# EAGLE design MonthCalendar_TouchPlate_v0.8 (EAGLE 9.4.1)
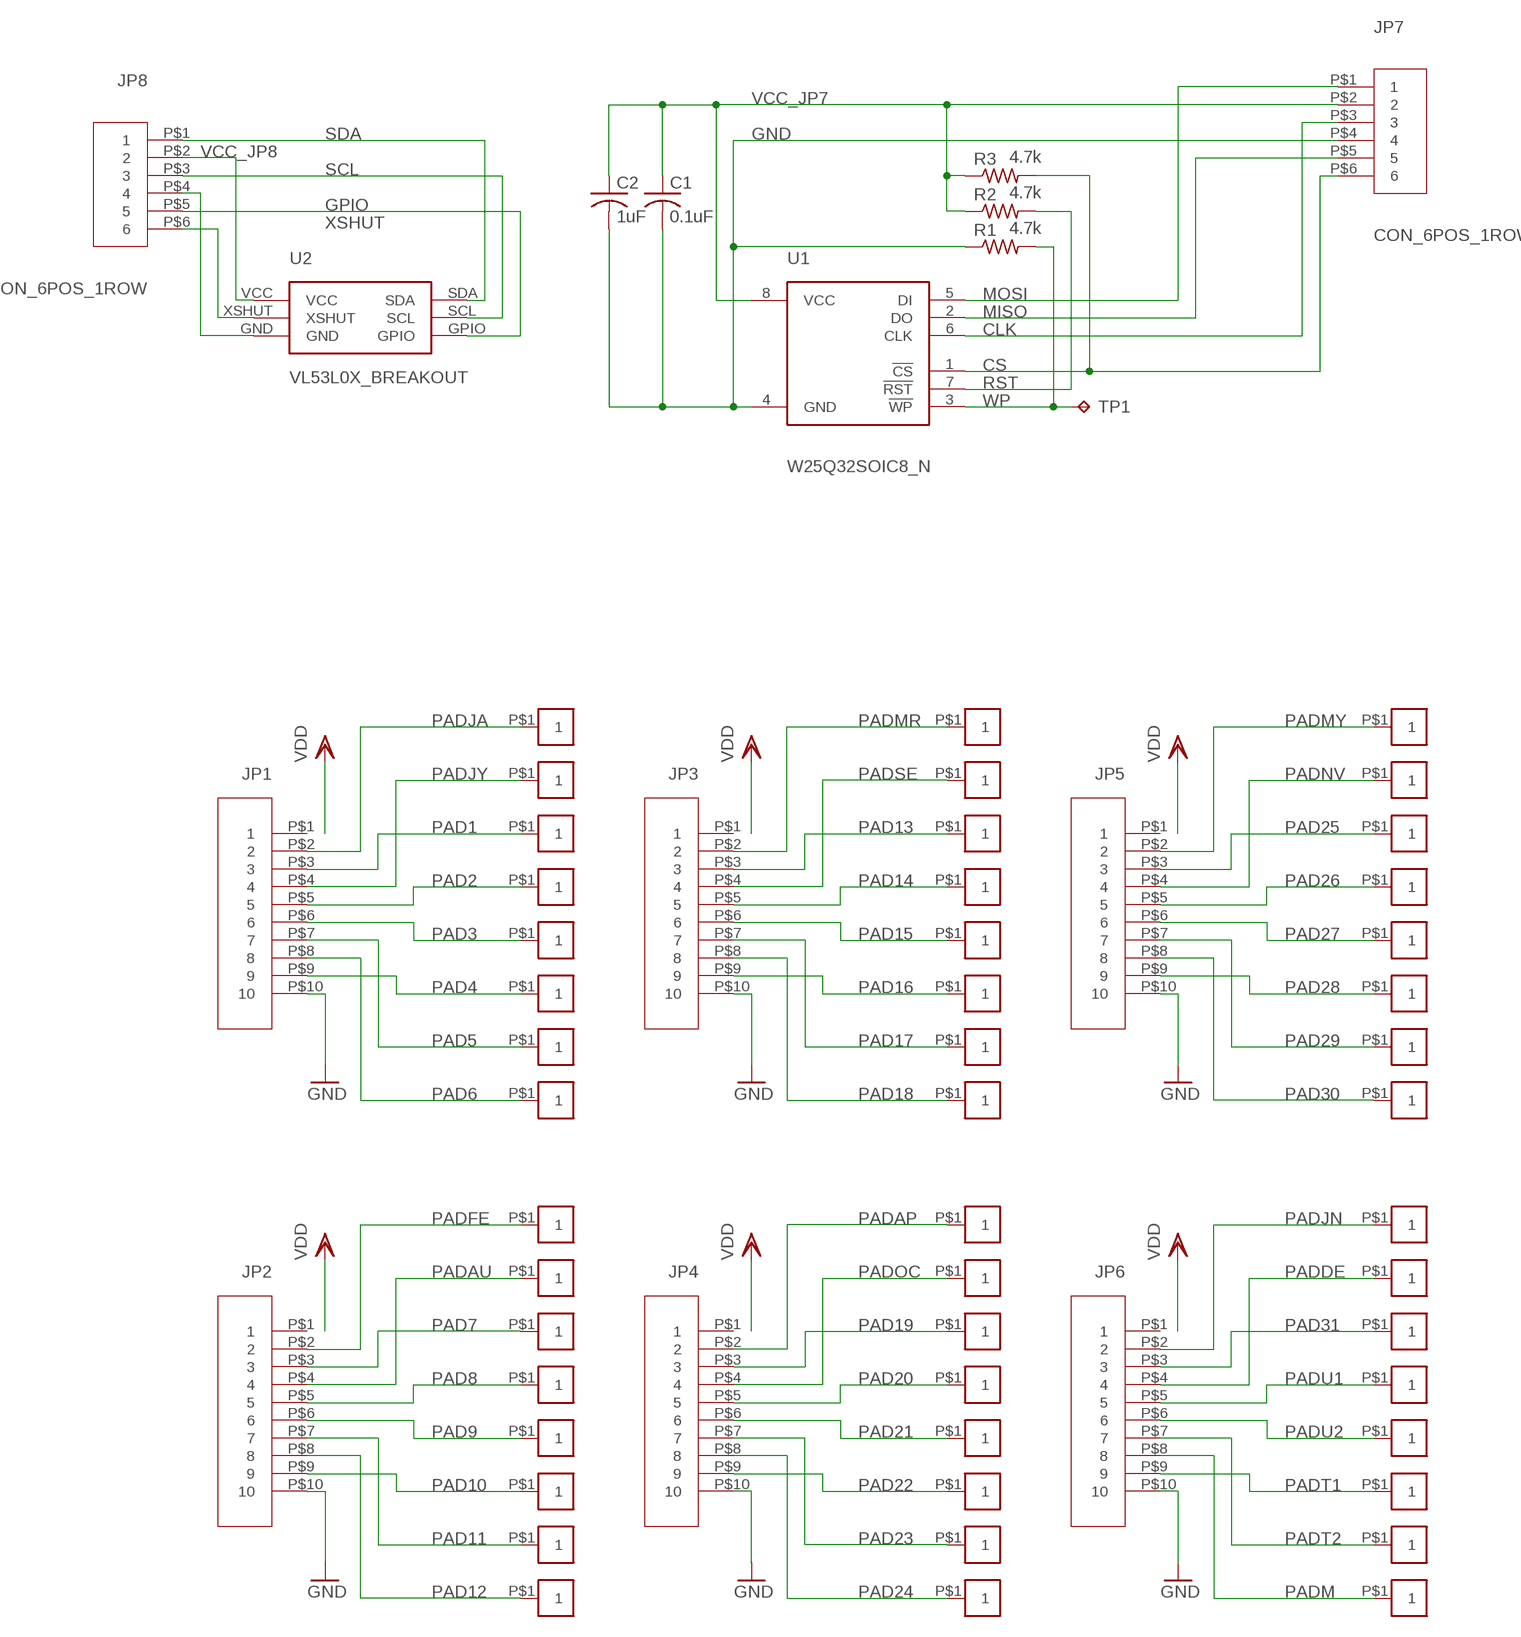
[diagram p0: schematic, sheet 1]

## Parts
C1  0.1uF  C-USC0603  [C0603]
C2  1uF  C-USC0603  [C0603]
JP1  CON_10POS_1ROWHARWIN_M50-3141045_N  [CON_RECPT_10P_1R_SMD_HARWIN_M50-3141045_NARROW]
JP2  CON_10POS_1ROWHARWIN_M50-3141045_N  [CON_RECPT_10P_1R_SMD_HARWIN_M50-3141045_NARROW]
JP3  CON_10POS_1ROWHARWIN_M50-3141045_N  [CON_RECPT_10P_1R_SMD_HARWIN_M50-3141045_NARROW]
JP4  CON_10POS_1ROWHARWIN_M50-3141045_N  [CON_RECPT_10P_1R_SMD_HARWIN_M50-3141045_NARROW]
JP5  CON_10POS_1ROWHARWIN_M50-3141045_N  [CON_RECPT_10P_1R_SMD_HARWIN_M50-3141045_NARROW]
JP6  CON_10POS_1ROWHARWIN_M50-3141045_N  [CON_RECPT_10P_1R_SMD_HARWIN_M50-3141045_NARROW]
JP7  CON_6POS_1ROW  [CON_RECPT_6P_1R_SMD_HARWIN_M50-3141045_NARROW]
JP8  CON_6POS_1ROW  [CON_RECPT_6P_1R_SMD_HARWIN_M50-3141045_NARROW]
R1  4.7k  R-US_R0603  [R0603]
R2  4.7k  R-US_R0603  [R0603]
R3  4.7k  R-US_R0603  [R0603]
TP1  TPTP20SQ  [TP20SQ]
U1  W25Q32SOIC8_N  [SOIC-8_NARROW]
U2  VL53L0X_BREAKOUT  [VL53L0X_BREAKOUT_THROUGHPCB]
U$1  PAD_CAPACITIVETOUCHV4  [PAD_CAPACITIVETOUCH_4]
U$2  PAD_CAPACITIVETOUCHV4  [PAD_CAPACITIVETOUCH_4]
U$3  PAD_CAPACITIVETOUCHV4  [PAD_CAPACITIVETOUCH_4]
U$4  PAD_CAPACITIVETOUCHV4  [PAD_CAPACITIVETOUCH_4]
U$5  PAD_CAPACITIVETOUCHV4  [PAD_CAPACITIVETOUCH_4]
U$6  PAD_CAPACITIVETOUCHV4  [PAD_CAPACITIVETOUCH_4]
U$7  PAD_CAPACITIVETOUCHV4  [PAD_CAPACITIVETOUCH_4]
U$8  PAD_CAPACITIVETOUCHV4  [PAD_CAPACITIVETOUCH_4]
U$9  PAD_CAPACITIVETOUCHV4  [PAD_CAPACITIVETOUCH_4]
U$10  PAD_CAPACITIVETOUCHV4  [PAD_CAPACITIVETOUCH_4]
U$11  PAD_CAPACITIVETOUCHV4  [PAD_CAPACITIVETOUCH_4]
U$12  PAD_CAPACITIVETOUCHV4  [PAD_CAPACITIVETOUCH_4]
U$13  PAD_CAPACITIVETOUCHV4  [PAD_CAPACITIVETOUCH_4]
U$14  PAD_CAPACITIVETOUCHV4  [PAD_CAPACITIVETOUCH_4]
U$15  PAD_CAPACITIVETOUCHV4  [PAD_CAPACITIVETOUCH_4]
U$16  PAD_CAPACITIVETOUCHV4  [PAD_CAPACITIVETOUCH_4]
U$17  PAD_CAPACITIVETOUCHV4  [PAD_CAPACITIVETOUCH_4]
U$18  PAD_CAPACITIVETOUCHV4  [PAD_CAPACITIVETOUCH_4]
U$19  PAD_CAPACITIVETOUCHV4  [PAD_CAPACITIVETOUCH_4]
U$20  PAD_CAPACITIVETOUCHV4  [PAD_CAPACITIVETOUCH_4]
U$21  PAD_CAPACITIVETOUCHV4  [PAD_CAPACITIVETOUCH_4]
U$22  PAD_CAPACITIVETOUCHV4  [PAD_CAPACITIVETOUCH_4]
U$23  PAD_CAPACITIVETOUCHV4  [PAD_CAPACITIVETOUCH_4]
U$24  PAD_CAPACITIVETOUCHV4  [PAD_CAPACITIVETOUCH_4]
U$25  PAD_CAPACITIVETOUCHV4  [PAD_CAPACITIVETOUCH_4]
U$26  PAD_CAPACITIVETOUCHV4  [PAD_CAPACITIVETOUCH_4]
U$27  PAD_CAPACITIVETOUCHV4  [PAD_CAPACITIVETOUCH_4]
U$28  PAD_CAPACITIVETOUCHV4  [PAD_CAPACITIVETOUCH_4]
U$29  PAD_CAPACITIVETOUCHV4  [PAD_CAPACITIVETOUCH_4]
U$30  PAD_CAPACITIVETOUCHV4  [PAD_CAPACITIVETOUCH_4]
U$31  PAD_CAPACITIVETOUCHV4  [PAD_CAPACITIVETOUCH_4]
U$32  PAD_CAPACITIVETOUCHV4  [PAD_CAPACITIVETOUCH_4]
U$33  PAD_CAPACITIVETOUCHV4  [PAD_CAPACITIVETOUCH_4]
U$34  PAD_CAPACITIVETOUCHV4  [PAD_CAPACITIVETOUCH_4]
U$35  PAD_CAPACITIVETOUCHV4  [PAD_CAPACITIVETOUCH_4]
U$36  PAD_CAPACITIVETOUCHV4  [PAD_CAPACITIVETOUCH_4]
U$37  PAD_CAPACITIVETOUCHV4  [PAD_CAPACITIVETOUCH_4]
U$38  PAD_CAPACITIVETOUCHV4  [PAD_CAPACITIVETOUCH_4]
U$39  PAD_CAPACITIVETOUCHV4  [PAD_CAPACITIVETOUCH_4]
U$40  PAD_CAPACITIVETOUCHV4  [PAD_CAPACITIVETOUCH_4]
U$41  PAD_CAPACITIVETOUCHV4  [PAD_CAPACITIVETOUCH_4]
U$42  PAD_CAPACITIVETOUCHV4  [PAD_CAPACITIVETOUCH_4]
U$43  PAD_CAPACITIVETOUCHV4  [PAD_CAPACITIVETOUCH_4]
U$44  PAD_CAPACITIVETOUCHV4  [PAD_CAPACITIVETOUCH_4]
U$45  PAD_CAPACITIVETOUCHV4  [PAD_CAPACITIVETOUCH_4]
U$46  PAD_CAPACITIVETOUCHV4  [PAD_CAPACITIVETOUCH_4]
U$47  PAD_CAPACITIVETOUCHV4  [PAD_CAPACITIVETOUCH_4]
U$48  PAD_CAPACITIVETOUCHV4  [PAD_CAPACITIVETOUCH_4]

## Nets
CLK: JP7.P$3 U1.6(CLK)
CS: JP7.P$6 R3.2 U1.1(!CS)
GND: C1.2 C2.2 JP1.P$10 JP2.P$10 JP3.P$10 JP4.P$10 JP5.P$10 JP6.P$10 JP7.P$4 JP8.P$4 R1.1 U1.4(GND) U2.GND
GPIO: JP8.P$5 U2.GPIO
MISO: JP7.P$5 U1.2(DO)
MOSI: JP7.P$1 U1.5(DI)
PAD1: JP1.P$3 U$3.P$1
PAD2: JP1.P$5 U$4.P$1
PAD3: JP1.P$6 U$5.P$1
PAD4: JP1.P$9 U$6.P$1
PAD5: JP1.P$7 U$7.P$1
PAD6: JP1.P$8 U$8.P$1
PAD7: JP2.P$3 U$11.P$1
PAD8: JP2.P$5 U$12.P$1
PAD9: JP2.P$6 U$13.P$1
PAD10: JP2.P$9 U$14.P$1
PAD11: JP2.P$7 U$15.P$1
PAD12: JP2.P$8 U$16.P$1
PAD13: JP3.P$3 U$19.P$1
PAD14: JP3.P$5 U$20.P$1
PAD15: JP3.P$6 U$21.P$1
PAD16: JP3.P$9 U$22.P$1
PAD17: JP3.P$7 U$23.P$1
PAD18: JP3.P$8 U$24.P$1
PAD19: JP4.P$3 U$27.P$1
PAD20: JP4.P$5 U$28.P$1
PAD21: JP4.P$6 U$29.P$1
PAD22: JP4.P$9 U$30.P$1
PAD23: JP4.P$7 U$31.P$1
PAD24: JP4.P$8 U$32.P$1
PAD25: JP5.P$3 U$35.P$1
PAD26: JP5.P$5 U$36.P$1
PAD27: JP5.P$6 U$37.P$1
PAD28: JP5.P$9 U$38.P$1
PAD29: JP5.P$7 U$39.P$1
PAD30: JP5.P$8 U$40.P$1
PAD31: JP6.P$3 U$43.P$1
PADAP: JP4.P$2 U$25.P$1
PADAU: JP2.P$4 U$10.P$1
PADDE: JP6.P$4 U$42.P$1
PADFE: JP2.P$2 U$9.P$1
PADJA: JP1.P$2 U$1.P$1
PADJN: JP6.P$2 U$41.P$1
PADJY: JP1.P$4 U$2.P$1
PADM: JP6.P$8 U$48.P$1
PADMR: JP3.P$2 U$17.P$1
PADMY: JP5.P$2 U$33.P$1
PADNV: JP5.P$4 U$34.P$1
PADOC: JP4.P$4 U$26.P$1
PADSE: JP3.P$4 U$18.P$1
PADT1: JP6.P$9 U$46.P$1
PADT2: JP6.P$7 U$47.P$1
PADU1: JP6.P$5 U$44.P$1
PADU2: JP6.P$6 U$45.P$1
RST: R2.2 U1.7(!RST)
SCL: JP8.P$3 U2.SCL
SDA: JP8.P$1 U2.SDA
VCC_JP7: C1.1 C2.1 JP7.P$2 R2.1 R3.1 U1.8(VCC)
VCC_JP8: JP8.P$2 U2.VCC
WP: R1.2 TP1.TP U1.3(!WP)
XSHUT: JP8.P$6 U2.XSHUT
Unconnected: JP1.P$1 JP2.P$1 JP3.P$1 JP4.P$1 JP5.P$1 JP6.P$1

## Library data of the parts
C1 C2 = resistor:C-US: CAPACITOR, American symbol
JP1-JP6 = MonthCalendar:CON_10POS_1ROW: Connector - 10 Position, 1 Row
JP7 JP8 = MonthCalendar:CON_6POS_1ROW: Connector - 6 Position, 1 Row
R1-R3 = resistor:R-US_: RESISTOR, American symbol
TP1 = testpad:TP: Test pad
U1 = MonthCalendar:W25Q32
U2 = MonthCalendar:VL53L0X_BREAKOUT: VL53L0X Breakout PCB
U$1-U$48 = MonthCalendar:PAD_CAPACITIVETOUCH: Capacitive Touch Pad with Numeric Inlay

## Board
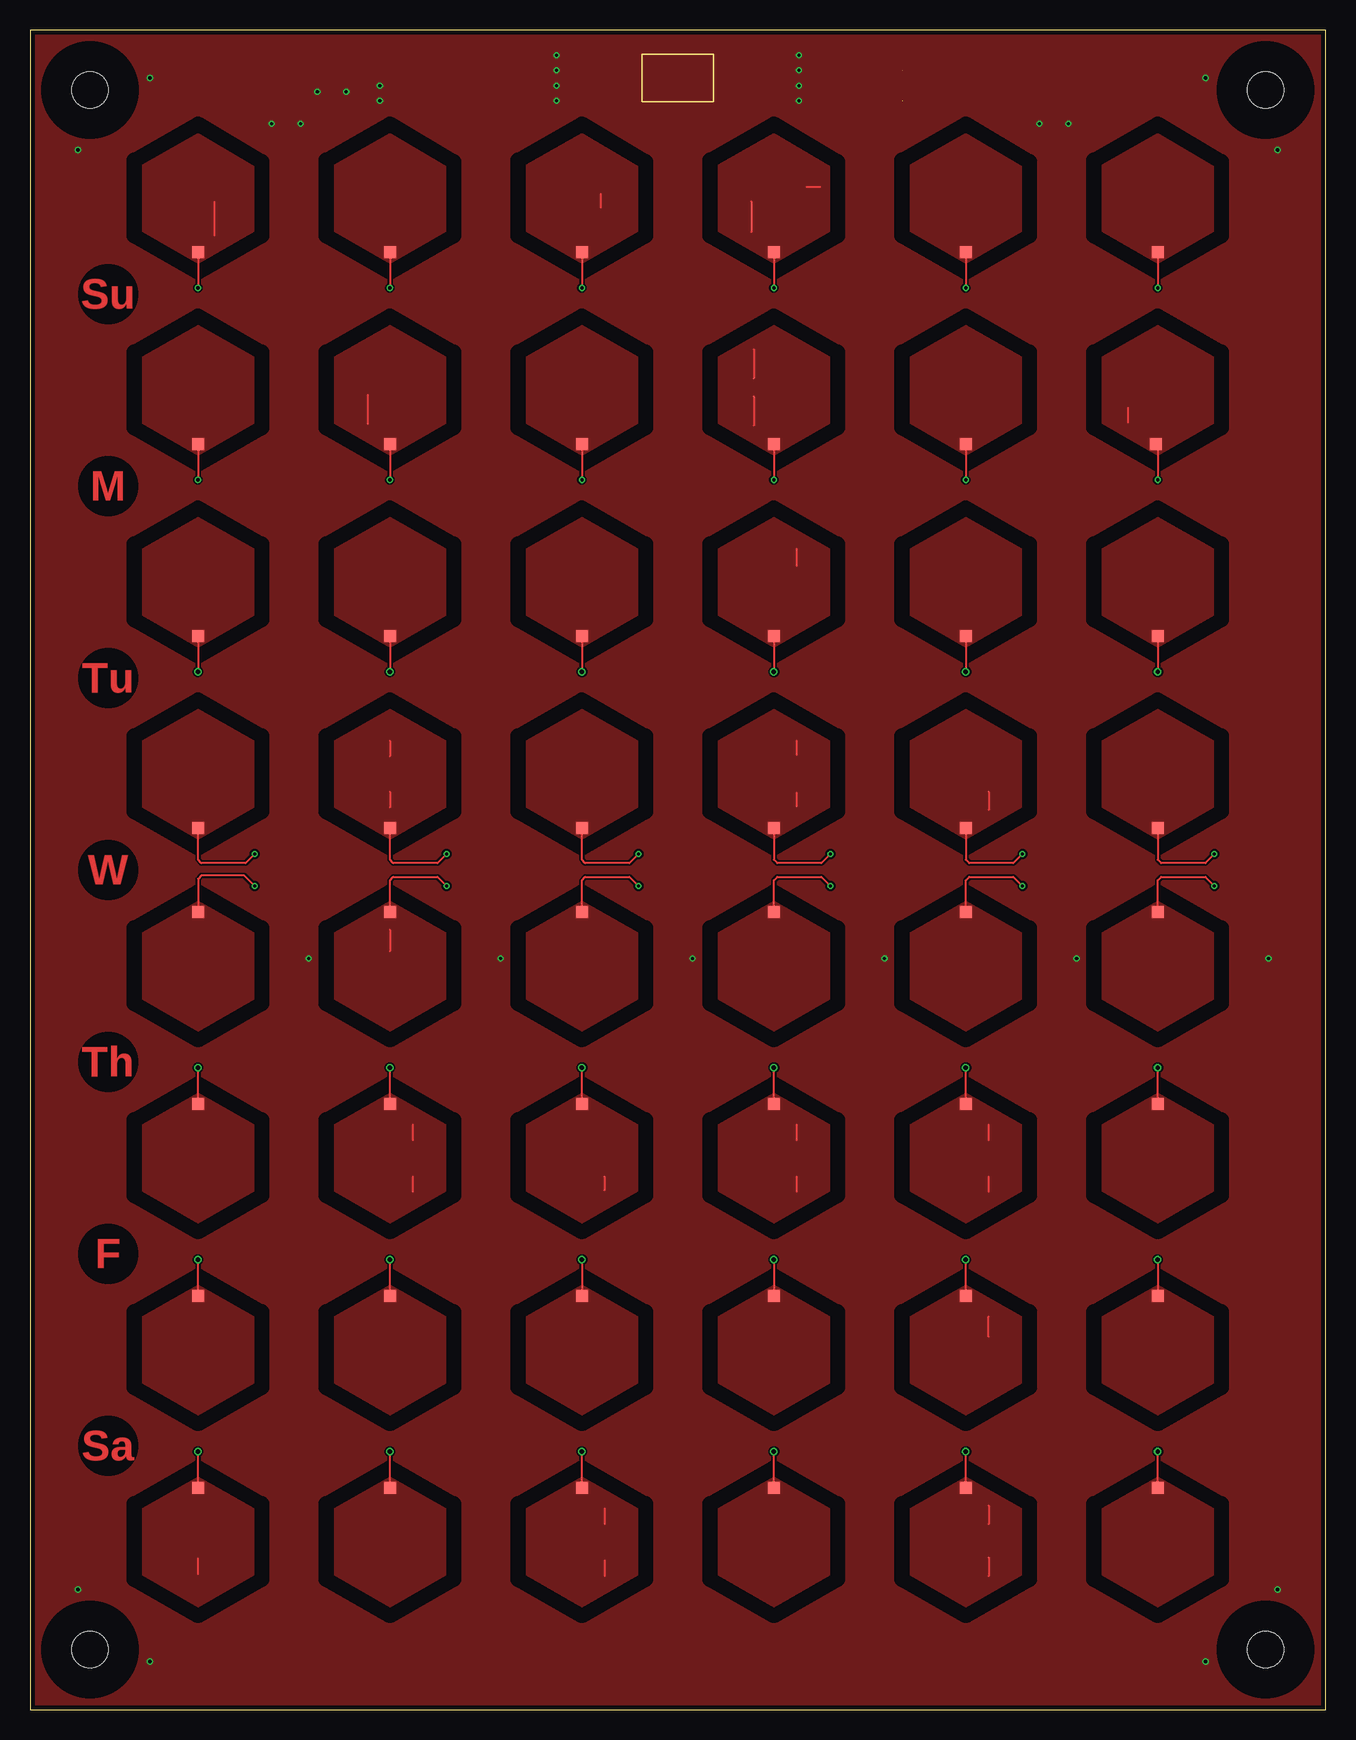
[diagram p1: board, top side]
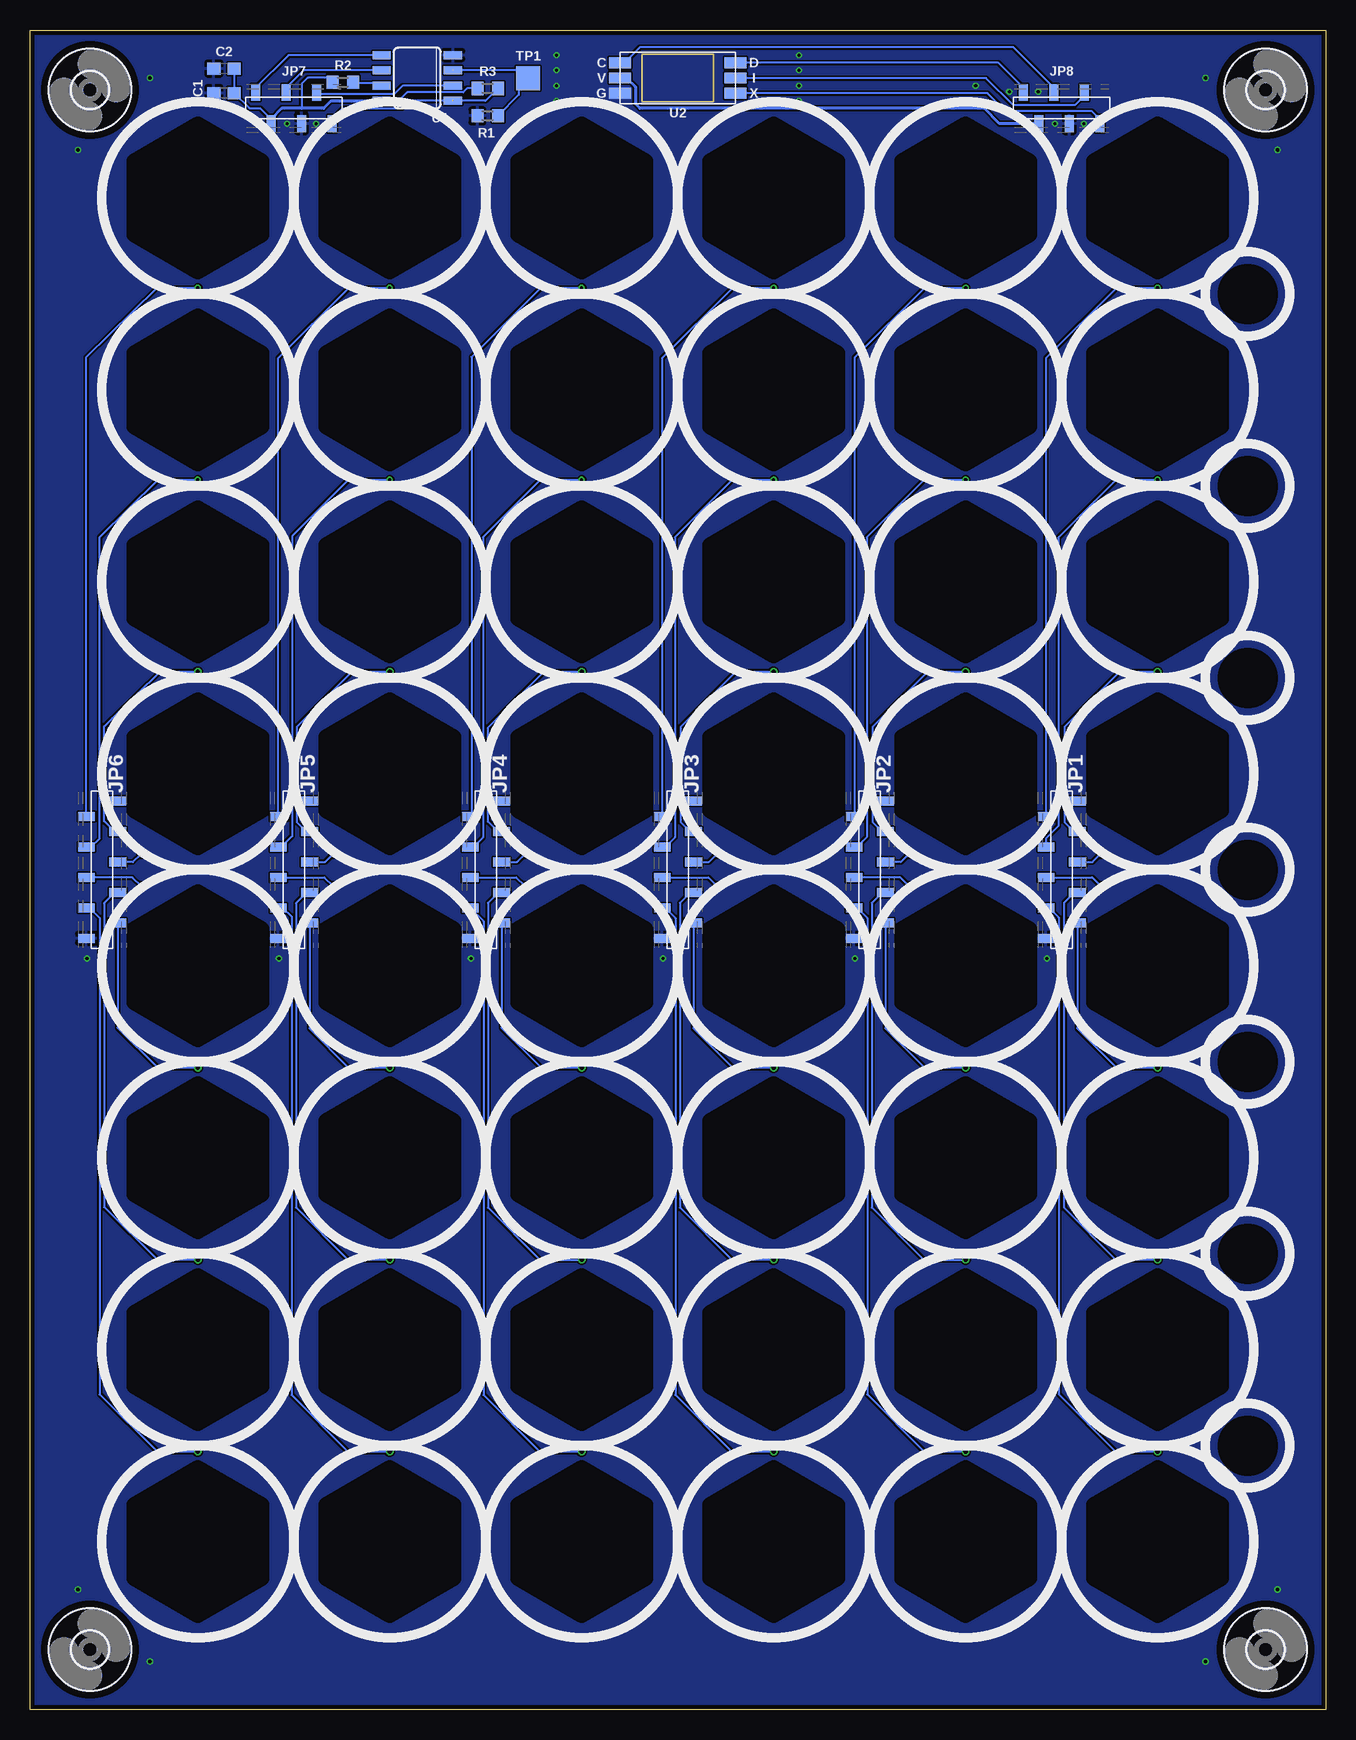
[diagram p2: board, bottom side, seen from below]

Size 108 x 140 mm. Coordinates in mm from the lower left corner, seen from the top.
Outline: 0,0 108,0 108,140 0,140 0,0
Copper layers (1*16): Top 0.035559375mm / dielectric 1.6mm / Bottom 0.035559375mm
Design rules "oshpark-2layer-tented": minimum track width 6mil, minimum drill 10mil, track to track 6mil, track to pad 6mil, pad to pad 6mil, via to via 6mil, smd to smd 6mil, copper to edge 15mil, drill to drill 6mil, minimum pad ring 5mil, minimum via ring 5mil, stop-mask expansion 2.5mil, vias tented up to drill 20mil, thermal gap 10mil
tRestrict: area 5.2,116.8 to 7.8,119.2; area 5.2,100.8 to 7.8,103.2; area 5.2,84.8 to 7.8,87.2; area 5.2,68.8 to 7.8,71.2; area 5.2,52.8 to 7.8,55.2; area 5.2,36.8 to 7.8,39.2; area 5.2,20.8 to 7.8,23.2; 288 lines
bRestrict: area 8.7,7.8 to 19.3,20.2; area 8.7,23.8 to 19.3,36.2; area 8.7,39.8 to 19.3,52.2; area 8.7,55.8 to 19.3,68.2; area 8.7,71.8 to 19.3,84.2; area 8.7,87.8 to 19.3,100.2; area 8.7,103.8 to 19.3,116.2; area 8.7,119.8 to 19.3,132.2; area 24.7,7.8 to 35.3,20.2; area 24.7,23.8 to 35.3,36.2; area 24.7,39.8 to 35.3,52.2; area 24.7,55.8 to 35.3,68.2; 43 more areas

### Footprints (pad centres in the part's own frame; a part is rotated, then mirrored left to right if it is on the bottom)
C0603 = smd 1.1 x 1: 1 -0.85,0; 2 0.85,0
3,0 = hole 3: 0,0
CON_RECPT_10P_1R_SMD_HARWIN_M50-3141045_NARROW = smd 0.74 x 1.4: P$1 -5.715,1.3; P$2 -4.445,-1.3; P$3 -3.175,1.3; P$4 -1.905,-1.3; P$5 -0.635,1.3; P$6 0.635,-1.3; P$7 1.905,1.3; P$8 3.175,-1.3; P$9 4.445,1.3; P$10 5.715,-1.3
CON_RECPT_6P_1R_SMD_HARWIN_M50-3141045_NARROW = smd 0.74 x 1.4: P$1 -3.175,1.3; P$2 -1.905,-1.3; P$3 -0.635,1.3; P$4 0.635,-1.3; P$5 1.905,1.3; P$6 3.175,-1.3
R0603 = smd 1 x 1.1: 1 -0.85,0; 2 0.85,0
TP20SQ = smd 2 x 2: TP 0,0
SOIC-8_NARROW = smd 0.66 x 1.524: 1 -1.905,-2.973; 2 -0.635,-2.973; 3 0.635,-2.973; 4 1.905,-2.973; 5 1.905,2.973; 6 0.635,2.973; 7 -0.635,2.973; 8 -1.905,2.973
VL53L0X_BREAKOUT_THROUGHPCB = smd 1.829 x 0.914: GND -4.826,-1.27; GPIO 4.826,0; SCL -4.826,1.27; SDA 4.826,1.27; VCC -4.826,0; XSHUT 4.826,-1.27
PAD_CAPACITIVETOUCH_4 = smd 1 x 1: P$1 0,0

### Placement (x,y rotation side)
C1  91.82,134.75 180 bottom
C2  91.82,136.78 180 bottom
HOLE_TL  [3,0]  5,135 0 bottom
JP1  22,70 270 bottom
JP2  38,70 270 bottom
JP3  54,70 270 bottom
JP4  70,70 270 bottom
JP5  86,70 270 bottom
JP6  102,70 270 bottom
JP7  86,133.5 0 bottom
JP8  22,133.5 0 bottom
R1  69.85,132.84 0 bottom
R2  81.92,135.64 0 bottom
R3  69.85,135.13 0 bottom
TP1  66.5,136 0 bottom
U1  75.71,136 90 bottom
U2  54,136 0 bottom
U$1  14,121.5 0 top
U$2  14,105.5 0 top
U$3  14,89.5 0 top
U$4  14,73.5 0 top
U$5  14,66.5 0 top
U$6  14,50.5 0 top
U$7  14,34.5 0 top
U$8  14,18.5 0 top
U$9  30,121.5 0 top
U$10  30,105.5 0 top
U$11  30,89.5 0 top
U$12  30,73.5 0 top
U$13  30,66.5 0 top
U$14  30,50.5 0 top
U$15  30,34.5 0 top
U$16  30,18.5 0 top
U$17  46,121.5 0 top
U$18  46,105.5 0 top
U$19  46,89.5 0 top
U$20  46,73.5 0 top
U$21  46,66.5 0 top
U$22  46,50.5 0 top
U$23  46,34.5 0 top
U$24  46,18.5 0 top
U$25  62,121.5 0 top
U$26  62,105.5 0 top
U$27  62,89.5 0 top
U$28  62,73.5 0 top
U$29  62,66.5 0 top
U$30  62,50.5 0 top
U$31  62,34.5 0 top
U$32  62,18.5 0 top
U$33  78,121.5 0 top
U$34  78,105.5 0 top
U$35  78,89.5 0 top
U$36  78,73.5 0 top
U$37  78,66.5 0 top
U$38  78,50.5 0 top
U$39  78,34.5 0 top
U$40  78,18.5 0 top
U$41  94,121.5 0 top
U$42  93.87,105.5 0 top
U$43  94,89.5 0 top
U$44  94,73.5 0 top
U$45  94,66.5 0 top
U$46  94,50.5 0 top
U$47  94,34.5 0 top
U$48  94,18.5 0 top
U$50  [3,0]  5,5 0 bottom
U$51  [3,0]  103,5 0 bottom
U$52  [3,0]  103,135 0 bottom

### Tracks (layer width: path | path; a pad name or v marks a point on that pad's centre or on a via)
CLK
  Bottom 0.152: JP7.P$3 86.64,135.18 85.18,136.63 U1.6
CS  (1 unrouted)
  Bottom 0.152: 72.77,134.09 76.34,134.09 76.96,133.48 81.93,133.48 82.83,132.58 JP7.P$6 | R3.2 70.03,134.09 U1.1
GND  (via drill 0.25)
  other vias: 10,4 4,10 98,4 104,10 10,136 4,130 104,130 98,136 23.24,62.61 39.24,62.61 55.24,62.61 71.25,62.61 87.25,62.61 103.25,62.61 64.09,135.37 22.56,132.19 43.9,137.91 43.9,136.63 43.9,135.37 43.9,134.09 64.09,136.63 84.16,132.19 86.57,132.19 23.96,134.86 26.37,134.86 29.17,134.09 29.17,135.37 20.15,132.19 64.09,137.91 64.09,134.09
  pour Bottom: 0,0 108,0 108,140 0,140
  pour Top (rank 2): 0,0 108,0 108,14 108,140 0,140
GPIO
  Bottom 0.152: JP8.P$5 20.09,134.55 20.91,133.73 26.04,133.73 28.3,136 U2.GPIO
MISO
  Bottom 0.152: JP7.P$5 83.97,134.7 77.6,134.7 76.93,135.37 U1.2
MOSI
  Bottom 0.152: JP7.P$1 89.17,135.18 86.45,137.91 U1.5
PAD1  (via drill 0.35)
  Top 0.152: U$3.P$1 v14,86.5
  Bottom 0.152: JP1.P$3 20.95,73.17 21.76,73.98 21.76,81.9 17.13,86.52 14.02,86.52 v14,86.5
  pour Top: 14,99.5 9.25,96.75 9.25,91.25 14,88.5 18.75,91.25 18.75,96.75
PAD2  (via drill 0.25)
  Top 0.152: U$4.P$1 14,70.83 14.29,70.55 17.97,70.55 v18.73,71.31
  Bottom 0.152: JP1.P$5 19.43,70.64 18.75,71.31 v18.73,71.31
  pour Top: 14,83.5 9.25,80.75 9.25,75.25 14,72.5 18.75,75.25 18.75,80.75
PAD3  (via drill 0.25)
  Top 0.152: U$5.P$1 14,69.25 14.29,69.53 17.84,69.53 v18.73,68.64
  Bottom 0.152: JP1.P$6 19.45,69.36 v18.73,68.64
  pour Top: 14,67.5 9.25,64.75 9.25,59.25 14,56.5 18.75,59.25 18.75,64.75
PAD4  (via drill 0.35)
  Top 0.152: U$6.P$1 v14,53.5
  Bottom 0.152: v14,53.5 17.41,53.5 20.7,56.79 JP1.P$9
  pour Top: 14,51.5 9.25,48.75 9.25,43.25 14,40.5 18.75,43.25 18.75,48.75
PAD5  (via drill 0.35)
  Top 0.152: U$7.P$1 v14,37.5
  Bottom 0.152: v14,37.5 17.46,37.5 21.78,41.81 21.78,67.27 20.95,68.09 JP1.P$7
  pour Top: 14,35.5 9.25,32.75 9.25,27.25 14,24.5 18.75,27.25 18.75,32.75
PAD6  (via drill 0.35)
  Top 0.152: U$8.P$1 v14,21.5 | 13.99,12.57 13.99,11.3
  Bottom 0.152: v14,21.5 17.46,21.5 22.24,26.28 22.24,66.02 23.05,66.83 JP1.P$8
  pour Top: 14,19.5 9.25,16.75 9.25,11.25 14,8.5 18.75,11.25 18.75,16.75
PAD7  (via drill 0.35)
  Top 0.152: U$11.P$1 v30,86.5
  Bottom 0.152: v30,86.5 30.02,86.52 33.14,86.52 37.76,81.9 37.76,73.98 36.95,73.17 JP2.P$3
  pour Top: 30,99.5 25.25,96.75 25.25,91.25 30,88.5 34.75,91.25 34.75,96.75
PAD8  (via drill 0.25)
  Top 0.152: U$12.P$1 30,70.83 30.29,70.55 33.97,70.55 v34.73,71.31 | 30,80.74 30,79.47 | 30,76.5 30,75.2
  Bottom 0.152: v34.73,71.31 35.41,70.64 JP2.P$5
  pour Top: 30,83.5 25.25,80.75 25.25,75.25 30,72.5 34.75,75.25 34.75,80.75
PAD9  (via drill 0.25)
  Top 0.152: v34.73,68.64 33.97,69.41 30.29,69.41 30,69.12 U$13.P$1 | 30,64.99 30,63.21
  Bottom 0.152: v34.73,68.64 35.46,69.36 JP2.P$6
  pour Top: 30,67.5 25.25,64.75 25.25,59.25 30,56.5 34.75,59.25 34.75,64.75
PAD10  (via drill 0.35)
  Top 0.152: U$14.P$1 v30,53.5 | 31.92,43.15 31.92,44.42 | 31.92,47.47 31.92,48.74
  Bottom 0.152: v30,53.5 33.41,53.5 36.7,56.79 JP2.P$9
  pour Top: 30,51.5 25.25,48.75 25.25,43.25 30,40.5 34.75,43.25 34.75,48.75
PAD11  (via drill 0.35)
  Top 0.152: U$15.P$1 v30,37.5
  Bottom 0.152: v30,37.5 33.47,37.5 37.81,41.85 37.81,67.23 36.95,68.09 JP2.P$7
  pour Top: 30,35.5 25.25,32.75 25.25,27.25 30,24.5 34.75,27.25 34.75,32.75
PAD12  (via drill 0.35)
  Top 0.152: U$16.P$1 v30,21.5
  Bottom 0.152: JP2.P$8 39.05,66.83 38.2,65.97 38.2,26.26 33.44,21.5 v30,21.5
  pour Top: 30,19.5 25.25,16.75 25.25,11.25 30,8.5 34.75,11.25 34.75,16.75
PAD13  (via drill 0.35)
  Top 0.152: U$19.P$1 | U$19.P$1 v46,86.5 | U$19.P$1
  Bottom 0.152: v46,86.5 46.03,86.52 49.14,86.52 53.76,81.9 53.76,73.98 52.95,73.17 JP3.P$3
  pour Top: 46,99.5 41.25,96.75 41.25,91.25 46,88.5 50.75,91.25 50.75,96.75
PAD14  (via drill 0.25)
  Top 0.152: 46.29,70.55 49.97,70.55 v50.74,71.31 | 46.1,70.74 46.29,70.55 | U$20.P$1 46,70.83 46.29,70.55
  Bottom 0.152: v50.74,71.31 51.41,70.64 JP3.P$5
  pour Top: 46,83.5 41.25,80.75 41.25,75.25 46,72.5 50.75,75.25 50.75,80.75
PAD15  (via drill 0.25)
  Top 0.152: v50.74,68.64 49.97,69.41 46.29,69.41 46,69.12 U$21.P$1
  Bottom 0.152: v50.74,68.64 51.46,69.36 JP3.P$6
  pour Top: 46,67.5 41.25,64.75 41.25,59.25 46,56.5 50.75,59.25 50.75,64.75
PAD16  (via drill 0.35)
  Top 0.152: U$22.P$1 v46,53.5 | 47.88,44.42 47.88,43.27
  Bottom 0.152: v46,53.5 49.42,53.5 52.7,56.78 JP3.P$9
  pour Top: 46,51.5 41.25,48.75 41.25,43.25 46,40.5 50.75,43.25 50.75,48.75
PAD17  (via drill 0.35)
  Top 0.152: U$23.P$1 v46,37.5
  Bottom 0.152: v46,37.5 49.47,37.5 53.82,41.85 53.82,67.23 52.95,68.09 JP3.P$7
  pour Top: 46,35.5 41.25,32.75 41.25,27.25 46,24.5 50.75,27.25 50.75,32.75
PAD18  (via drill 0.35)
  Top 0.152: U$24.P$1 v46,21.5 | 47.9,12.41 47.9,11.14 | 47.9,16.73 47.9,15.46
  Bottom 0.152: v46,21.5 49.47,21.5 54.2,26.23 54.2,65.98 55.05,66.83 JP3.P$8
  pour Top: 46,19.5 41.25,16.75 41.25,11.25 46,8.5 50.75,11.25 50.75,16.75
PAD19  (via drill 0.35)
  Top 0.152: U$27.P$1 v62.01,86.5 | 63.93,95.34 63.93,96.74
  Bottom 0.152: v62.01,86.5 62.03,86.52 65.14,86.52 69.82,81.85 69.82,74.01 68.98,73.17 JP4.P$3
  pour Top: 62.01,99.5 57.26,96.75 57.26,91.25 62.01,88.5 66.76,91.25 66.76,96.75
PAD20  (via drill 0.25)
  Top 0.152: v66.74,71.31 65.98,70.55 62.29,70.55 62,70.83 U$28.P$1 | 63.91,76.42 63.91,75.28 | 63.91,80.74 63.91,79.6
  Bottom 0.152: v66.74,71.31 67.41,70.64 JP4.P$5
  pour Top: 62.01,83.5 57.26,80.75 57.26,75.25 62.01,72.5 66.76,75.25 66.76,80.75
PAD21  (via drill 0.25)
  Top 0.152: v66.74,68.64 65.98,69.41 62.29,69.41 62,69.12 U$29.P$1
  Bottom 0.152: v66.74,68.64 67.46,69.36 JP4.P$6
  pour Top: 62.01,67.5 57.26,64.75 57.26,59.25 62.01,56.5 66.76,59.25 66.76,64.75
PAD22  (via drill 0.35)
  Top 0.152: U$30.P$1 v62.01,53.5 | 63.92,43.15 63.92,44.42 | 63.92,47.47 63.92,48.74
  Bottom 0.152: v62.01,53.5 65.37,53.5 68.7,56.83 JP4.P$9
  pour Top: 62.01,51.5 57.26,48.75 57.26,43.25 62.01,40.5 66.76,43.25 66.76,48.75
PAD23  (via drill 0.35)
  Top 0.152: v62,37.5 U$31.P$1
  Bottom 0.152: v62,37.5 65.47,37.5 69.82,41.85 69.82,67.23 68.95,68.09 JP4.P$7
  pour Top: 62.01,35.5 57.26,32.75 57.26,27.25 62.01,24.5 66.76,27.25 66.76,32.75
PAD24  (via drill 0.35)
  Top 0.152: U$32.P$1 v62.01,21.5
  Bottom 0.152: v62.01,21.5 65.47,21.5 70.2,26.23 70.2,65.72 JP4.P$8
  pour Top: 62.01,19.5 57.26,16.75 57.26,11.25 62.01,8.5 66.76,11.25 66.76,16.75
PAD25  (via drill 0.35)
  Top 0.152: U$35.P$1 v78.01,86.5
  Bottom 0.152: v78.01,86.5 78.03,86.52 81.14,86.52 85.76,81.9 85.76,73.98 84.95,73.17 JP5.P$3
  pour Top: 78.01,99.5 73.26,96.75 73.26,91.25 78.01,88.5 82.76,91.25 82.76,96.75
PAD26  (via drill 0.25)
  Top 0.152: v82.74,71.31 81.98,70.55 78.3,70.55 78.01,70.83 U$36.P$1 | 79.92,76.5 79.92,75
  Bottom 0.152: v82.74,71.31 83.42,70.64 JP5.P$5
  pour Top: 78.01,83.5 73.26,80.75 73.26,75.25 78.01,72.5 82.76,75.25 82.76,80.75
PAD27  (via drill 0.25)
  Top 0.152: v82.74,68.64 81.98,69.41 78.3,69.41 78.01,69.12 U$37.P$1
  Bottom 0.152: v82.74,68.64 83.46,69.36 JP5.P$6
  pour Top: 78.01,67.5 73.26,64.75 73.26,59.25 78.01,56.5 82.76,59.25 82.76,64.75
PAD28  (via drill 0.35)
  Top 0.152: U$38.P$1 v78.01,53.5 | 79.93,43.15 79.93,44.42 | 79.93,47.47 79.93,48.74
  Bottom 0.152: v78.01,53.5 81.42,53.5 84.7,56.78 JP5.P$9
  pour Top: 78.01,51.5 73.26,48.75 73.26,43.25 78.01,40.5 82.76,43.25 82.76,48.75
PAD29  (via drill 0.35)
  Top 0.152: U$39.P$1 v78,37.5 | 79.91,31.08 79.91,32.73
  Bottom 0.152: v78,37.5 81.47,37.5 85.82,41.85 85.82,67.23 84.95,68.09 JP5.P$7
  pour Top: 78.01,35.5 73.26,32.75 73.26,27.25 78.01,24.5 82.76,27.25 82.76,32.75
PAD30  (via drill 0.35)
  Top 0.152: U$40.P$1 v78.01,21.5 | 79.92,16.99 79.92,15.46 | 79.92,12.67 79.92,11.14
  Bottom 0.152: v78.01,21.5 81.47,21.5 86.2,26.23 86.2,66.11 86.92,66.83 JP5.P$8
  pour Top: 78.01,19.5 73.26,16.75 73.26,11.25 78.01,8.5 82.76,11.25 82.76,16.75
PAD31  (via drill 0.35)
  Top 0.152: U$43.P$1 v94.01,86.5
  Bottom 0.152: v94.01,86.5 94.03,86.52 97.14,86.52 101.16,82.62 101.82,81.95 101.82,74.04 100.95,73.17 JP6.P$3
  pour Top: 94.01,99.5 89.26,96.75 89.26,91.25 94.01,88.5 98.76,91.25 98.76,96.75
PADAP  (via drill 0.25)
  Top 0.152: 60.15,125.7 60.15,123.16 | 64.74,126.92 65.88,126.92 | U$25.P$1 v62.01,118.5
  Bottom 0.152: v62.01,118.5 65.44,118.5 71.21,112.74 71.21,74.54 JP4.P$2
  pour Top: 62.01,131.5 57.26,128.75 57.26,123.25 62.01,120.5 66.76,123.25 66.76,128.75
PADAU  (via drill 0.25)
  Top 0.152: U$10.P$1 v30,102.5 | 28.15,109.57 28.15,107.16
  Bottom 0.152: v30,102.5 33.47,102.5 38.24,97.72 38.24,72.71 39.05,71.91 JP2.P$4
  pour Top: 30,115.5 25.25,112.75 25.25,107.25 30,104.5 34.75,107.25 34.75,112.75
PADDE  (via drill 0.25)
  Top 0.152: 94.01,105.5 v94.01,102.5 | 91.52,108.5 91.52,107.28
  Bottom 0.152: v94.01,102.5 97.34,102.5 102.2,97.71 102.2,72.62 102.92,71.91 JP6.P$4
  pour Top: 94.01,115.5 89.26,112.75 89.26,107.25 94.01,104.5 98.76,107.25 98.76,112.75
PADFE  (via drill 0.25)
  Top 0.152: U$9.P$1 v30,118.5
  Bottom 0.152: v30,118.5 33.44,118.5 39.27,112.67 39.27,74.48 JP2.P$2
  pour Top: 30,131.5 25.25,128.75 25.25,123.25 30,120.5 34.75,123.25 34.75,128.75
PADJA  (via drill 0.25)
  Top 0.152: U$1.P$1 v14,118.5 | 15.37,125.67 15.37,122.87
  Bottom 0.152: v14,118.5 17.44,118.5 23.3,112.64 JP1.P$2
  pour Top: 14,131.5 9.25,128.75 9.25,123.25 14,120.5 18.75,123.25 18.75,128.75
PADJN  (via drill 0.25)
  Top 0.152: U$41.P$1 v94.01,118.5
  Bottom 0.152: v94.01,118.5 97.43,118.5 103.3,112.73 JP6.P$2
  pour Top: 94.01,131.5 89.26,128.75 89.26,123.25 94.01,120.5 98.76,123.25 98.76,128.75
PADJY  (via drill 0.25)
  Top 0.152: U$2.P$1 v14,102.5
  Bottom 0.152: v14,102.5 17.46,102.5 22.29,97.68 22.29,73.63 23.3,72.62 JP1.P$4
  pour Top: 14,115.5 9.25,112.75 9.25,107.25 14,104.5 18.75,107.25 18.75,112.75
PADM  (via drill 0.35)
  Top 0.152: U$48.P$1 v94.01,21.5
  Bottom 0.152: v94.01,21.5 97.35,21.5 102.2,26.26 102.2,65.98 103.05,66.83 JP6.P$8
  pour Top: 94.01,19.5 89.26,16.75 89.26,11.25 94.01,8.5 98.76,11.25 98.76,16.75
PADMR  (via drill 0.25)
  Top 0.152: U$17.P$1 v46,118.5 | 47.59,125.19 47.59,126.33
  Bottom 0.152: v46,118.5 49.44,118.5 55.3,112.64 JP3.P$2
  pour Top: 46,131.5 41.25,128.75 41.25,123.25 46,120.5 50.75,123.25 50.75,128.75
PADMY  (via drill 0.25)
  Top 0.152: U$33.P$1 v78.01,118.5
  Bottom 0.152: v78.01,118.5 81.45,118.5 87.3,112.65 JP5.P$2
  pour Top: 78.01,131.5 73.26,128.75 73.26,123.25 78.01,120.5 82.76,123.25 82.76,128.75
PADNV  (via drill 0.25)
  Top 0.152: U$34.P$1 v78.01,102.5
  Bottom 0.152: v78.01,102.5 81.47,102.5 86.14,97.83 86.14,72.81 87.05,71.91 JP5.P$4
  pour Top: 78.01,115.5 73.26,112.75 73.26,107.25 78.01,104.5 82.76,107.25 82.76,112.75
PADOC  (via drill 0.25)
  Top 0.152: U$26.P$1 v62.01,102.5 | 60.35,113.38 60.35,110.97 | 60.35,109.44 60.35,107.03
  Bottom 0.152: v62.01,102.5 65.47,102.5 70.25,97.72 70.25,72.69 71.03,71.91 JP4.P$4
  pour Top: 62.01,115.5 57.26,112.75 57.26,107.25 62.01,104.5 66.76,107.25 66.76,112.75
PADSE  (via drill 0.25)
  Top 0.152: U$18.P$1 v46,102.5
  Bottom 0.152: v46,102.5 49.47,102.5 54.25,97.72 54.25,72.7 55.05,71.91 JP3.P$4
  pour Top: 46,115.5 41.25,112.75 41.25,107.25 46,104.5 50.75,107.25 50.75,112.75
PADT1  (via drill 0.35)
  Top 0.152: U$46.P$1 v94.01,53.5
  Bottom 0.152: v94.01,53.5 97.3,53.5 100.7,56.83 JP6.P$9
  pour Top: 94.01,51.5 89.26,48.75 89.26,43.25 94.01,40.5 98.76,43.25 98.76,48.75
PADT2  (via drill 0.35)
  Top 0.152: v94,37.5 U$47.P$1
  Bottom 0.152: v94,37.5 97.34,37.5 101.82,41.9 101.82,67.23 100.95,68.09 JP6.P$7
  pour Top: 94.01,35.5 89.26,32.75 89.26,27.25 94.01,24.5 98.76,27.25 98.76,32.75
PADU1  (via drill 0.25)
  Top 0.152: v98.74,71.31 97.98,70.55 94.3,70.55 94.01,70.83 U$44.P$1
  Bottom 0.152: v98.74,71.31 99.42,70.64 JP6.P$5
  pour Top: 94.01,83.5 89.26,80.75 89.26,75.25 94.01,72.5 98.76,75.25 98.76,80.75
PADU2  (via drill 0.25)
  Top 0.152: v98.74,68.64 97.98,69.41 94.3,69.41 94.01,69.12 U$45.P$1
  Bottom 0.152: v98.74,68.64 99.46,69.36 JP6.P$6
  pour Top: 94.01,67.5 89.26,64.75 89.26,59.25 94.01,56.5 98.76,59.25 98.76,64.75
RST
  Bottom 0.152: 80.79,135.37 80.98,135.55 | 80.98,135.55 R2.2 | U1.7 78.88,135.55 80.98,135.55
SCL
  Bottom 0.152: JP8.P$3 22.64,135.18 26.01,138.56 57.16,138.56 58.45,137.27 U2.SCL
SDA
  Bottom 0.152: JP8.P$1 25.18,135.18 27.26,137.27 U2.SDA
VCC_JP7
  Bottom 0.152: R2.1 83.15,136.02 84.84,136.02 85.34,135.51 85.34,133.48 | C2.1 C1.1 89.7,133.48 88.8,133.48 87.91,132.58 | U1.8 77.26,134.09 76.55,134.81 71.88,134.81 71.56,135.13 R3.1
  Bottom 0.254: U1.8 82.89,134.09 83.51,133.48 85.34,133.48 87.01,133.48 87.91,132.58 JP7.P$2
VCC_JP8
  Bottom 0.254: JP8.P$2 27.17,132.2 28.45,133.48 57.15,133.48 57.53,133.86 57.53,135.25 58.28,136 U2.VCC
WP  (1 unrouted)
  Bottom 0.152: R1.2 69,133.01 | R1.2 68.96,132.88 | 72.72,136.65 67.15,136.65 TP1.TP 67.26,135.24 67.26,134.6 69,132.87 R1.2
XSHUT
  Bottom 0.152: JP8.P$6 18.82,132.58 19.47,133.22 26.67,133.22 28.18,134.73 U2.XSHUT

### Text on the board
Top: Su | M | Tu | W | Th | F | Sa
tStop: JA | FE | MR | AP | MY | JN | JY | AU | SE | OC | NV | DE | 1 | 7 | 13 | 19 | 25 | 31 | 2 | 8 | 14 | 20 | 26 | U1 | 3 | 9 | 15 | 21 | 27 | U2 | 4 | 10 | 16 | 22 | 28 | T1 | 5 | 11 | 17 | 23 | 29 | T2 | 6 | 12 | 18 | 24 | 30 | M
tRestrict: JA | FE | MR | AP | MY | JN | JY | AU | SE | OC | NV | DE | 1 | 7 | 13 | 19 | 25 | 31 | 2 | 8 | 14 | 20 | 26 | U1 | 3 | 9 | 15 | 21 | 27 | U2 | 4 | 10 | 16 | 22 | 28 | T1 | 5 | 11 | 17 | 23 | 29 | T2 | 6 | 12 | 18 | 24 | 30 | M
bRestrict: JA | FE | MR | AP | MY | JN | JY | AU | SE | OC | NV | DE | 1 | 7 | 13 | 19 | 25 | 31 | 2 | 8 | 14 | 20 | 26 | U1 | 3 | 9 | 15 | 21 | 27 | U2 | 4 | 10 | 16 | 22 | 28 | T1 | 5 | 11 | 17 | 23 | 29 | T2 | 6 | 12 | 18 | 24 | 30 | M